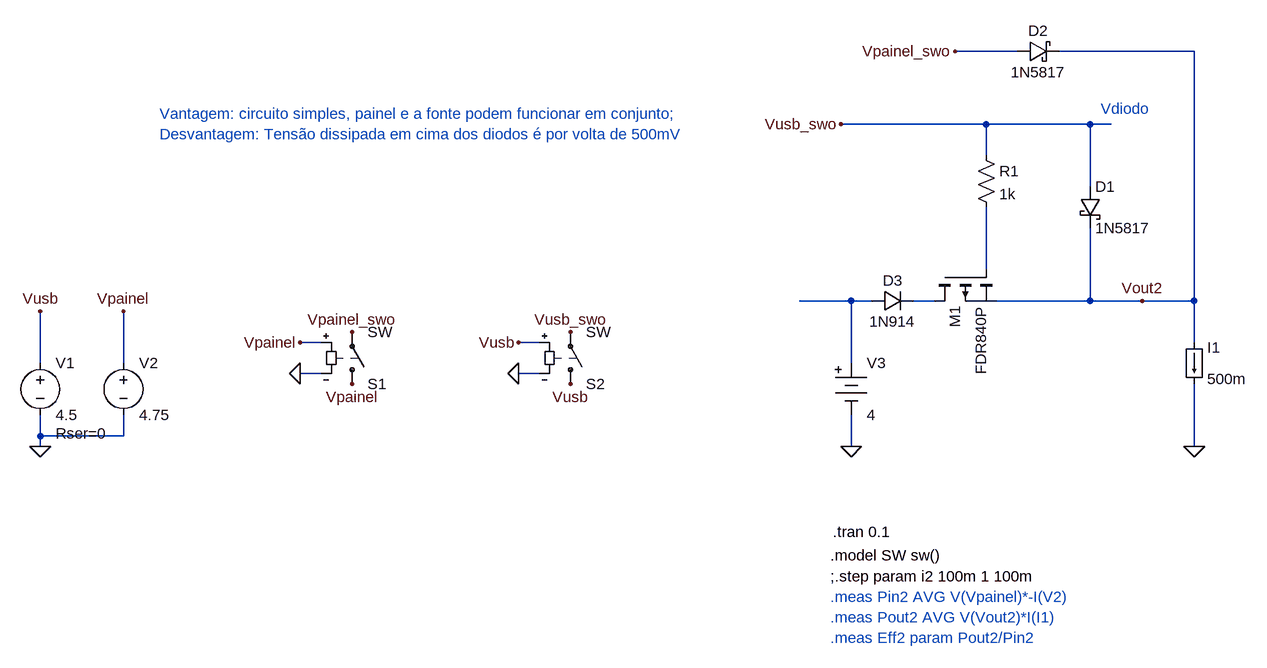
[diagram p0: schematic power_path_heltec_2.asc]
power_path_heltec_2.asc, the LTspice schematic file:
Version 4
SHEET 1 1692 1024
WIRE 1264 112 1168 112
WIRE 1536 112 1328 112
WIRE 1216 224 992 224
WIRE 1376 224 1216 224
WIRE 1408 224 1376 224
WIRE 1216 272 1216 224
WIRE 1376 320 1376 224
WIRE 1216 448 1216 352
WIRE 1008 496 928 496
WIRE 1040 496 1008 496
WIRE 1136 496 1104 496
WIRE 1376 496 1376 384
WIRE 1376 496 1232 496
WIRE 1456 496 1376 496
WIRE 1536 496 1536 112
WIRE 1536 496 1456 496
WIRE 192 560 160 560
WIRE 528 560 496 560
WIRE 1536 560 1536 496
WIRE -240 592 -240 512
WIRE -112 592 -112 512
WIRE 1008 592 1008 496
WIRE 192 608 160 608
WIRE 528 608 496 608
WIRE -240 704 -240 672
WIRE -112 704 -112 672
WIRE -112 704 -240 704
WIRE -240 720 -240 704
WIRE 1008 720 1008 672
WIRE 1536 720 1536 624
FLAG -240 720 0
FLAG -240 512 Vusb
FLAG -112 512 Vpainel
FLAG 1008 720 0
FLAG 1536 720 0
FLAG 992 224 Vusb_swo
FLAG 1168 112 Vpainel_swo
FLAG 160 560 Vpainel
FLAG 160 608 0
FLAG 496 608 0
FLAG 496 560 Vusb
FLAG 576 624 Vusb
FLAG 576 544 Vusb_swo
FLAG 240 624 Vpainel
FLAG 240 544 Vpainel_swo
FLAG 1456 496 Vout2
DATAFLAG -112 544 ""
DATAFLAG 1536 496 ""
DATAFLAG 944 496 ""
DATAFLAG 1408 224 "$-V(N005)"
DATAFLAG -240 544 ""
SYMBOL voltage -240 576 R0
WINDOW 123 0 0 Left 0
WINDOW 39 24 124 Left 2
SYMATTR SpiceLine Rser=0
SYMATTR InstName V1
SYMATTR Value 4.5
SYMBOL voltage -112 576 R0
WINDOW 123 0 0 Left 0
WINDOW 39 0 0 Left 0
SYMATTR InstName V2
SYMATTR Value 4.75
SYMBOL pmos 1136 448 M90
SYMATTR InstName M1
SYMATTR Value FDR840P
SYMBOL res 1200 256 R0
SYMATTR InstName R1
SYMATTR Value 1k
SYMBOL schottky 1360 320 R0
SYMATTR InstName D1
SYMATTR Value 1N5817
SYMBOL Misc\\battery 1008 576 R0
WINDOW 123 0 0 Left 0
WINDOW 39 0 0 Left 0
SYMATTR InstName V3
SYMATTR Value 4
SYMBOL schottky 1264 128 R270
WINDOW 0 32 32 VTop 2
WINDOW 3 0 32 VBottom 2
SYMATTR InstName D2
SYMATTR Value 1N5817
SYMATTR Description Diode
SYMATTR Type diode
SYMBOL diode 1040 512 R270
WINDOW 0 32 32 VTop 2
WINDOW 3 0 32 VBottom 2
SYMATTR InstName D3
SYMATTR Value 1N914
SYMBOL sw 240 640 M180
SYMATTR InstName S1
SYMBOL sw 576 640 M180
SYMATTR InstName S2
SYMBOL load 1520 560 R0
WINDOW 123 0 0 Left 0
WINDOW 39 0 0 Left 0
SYMATTR InstName I1
SYMATTR Value 500m
TEXT -56 208 Left 2 ;Vantagem: circuito simples, painel e a fonte podem funcionar em conjunto;\nDesvantagem: Tensão dissipada em cima dos diodos é por volta de 500mV
TEXT 1392 200 Left 2 ;Vdiodo
TEXT 976 952 Left 2 ;.meas Pin2 AVG V(Vpainel)*-I(V2)\n.meas Pout2 AVG V(Vout2)*I(I1)\n.meas Eff2 param Pout2/Pin2
TEXT 976 920 Left 2 !;.step param i2 100m 1 100m
TEXT 980 852 Left 2 !.tran 0.1
TEXT 976 888 Left 2 !.model SW sw()

The netlist it stands for:
* power_path_heltec_2.asc
V1 Vusb 0 4.5 Rser=0
V2 Vpainel 0 4.75
M1 N003 N001 Vout2 Vout2 FDR840P
R1 Vusb_swo N001 1k
D1 Vusb_swo Vout2 1N5817
V3 N002 0 4
D2 Vpainel_swo Vout2 1N5817
D3 N002 N003 1N914
S1 Vpainel Vpainel_swo Vpainel 0 SW
S2 Vusb Vusb_swo Vusb 0 SW
I1 Vout2 0 500m
.model D D
.lib standard.dio
.model NMOS NMOS
.model PMOS PMOS
.lib standard.mos
* Vantagem: circuito simples, painel e a fonte podem funcionar em conjunto;
* Desvantagem: Tensão dissipada em cima dos diodos é por volta de 500mV
* Vdiodo
* .meas Pin2 AVG V(Vpainel)*-I(V2)
* .meas Pout2 AVG V(Vout2)*I(I1)
* .meas Eff2 param Pout2/Pin2
;.step param i2 100m 1 100m
.tran 0.1
.model SW sw()
.backanno
.end